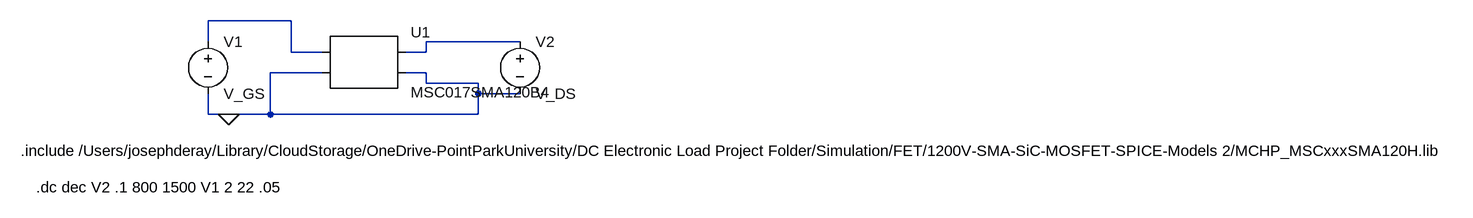
[diagram p0: schematic MSC025SMA120B4-FET-Charcteristics.asc]
MSC025SMA120B4-FET-Charcteristics.asc, the LTspice schematic file:
Version 4
SHEET 1 2020 680
WIRE 288 272 160 272
WIRE 160 304 160 272
WIRE 640 304 496 304
WIRE 288 320 288 272
WIRE 336 320 288 320
WIRE 496 320 496 304
WIRE 496 320 464 320
WIRE 336 352 256 352
WIRE 496 352 464 352
WIRE 496 368 496 352
WIRE 576 368 496 368
WIRE 576 384 576 368
WIRE 640 384 576 384
WIRE 160 416 160 384
WIRE 192 416 160 416
WIRE 256 416 256 352
WIRE 256 416 192 416
WIRE 576 416 576 384
WIRE 576 416 256 416
FLAG 192 416 0
SYMBOL AutoGenerated/MSC017SMA120B4 400 336 R0
SYMATTR InstName U1
SYMBOL voltage 160 288 R0
SYMATTR InstName V1
SYMATTR Value V_GS
SYMBOL voltage 640 288 R0
SYMATTR InstName V2
SYMATTR Value V_DS
TEXT -104 528 Left 2 !.dc dec V2 .1 800 1500 V1 2 22 .05
TEXT -128 472 Left 2 !.include /Users/josephderay/Library/CloudStorage/OneDrive-PointParkUniversity/DC Electronic Load Project Folder/Simulation/FET/1200V-SMA-SiC-MOSFET-SPICE-Models 2/MCHP_MSCxxxSMA120H.lib

The netlist it stands for:
* MSC025SMA120B4-FET-Charcteristics.asc
* U1: MSC017SMA120B4 (symbol AutoGenerated/MSC017SMA120B4 not available, pins judged from their places): pin1=N001 pin2=0 pin3=N002 pin4=0
V1 N001 0 V_GS
V2 N002 0 V_DS
.dc dec V2 .1 800 1500 V1 2 22 .05
.include /Users/josephderay/Library/CloudStorage/OneDrive-PointParkUniversity/DC Electronic Load Project Folder/Simulation/FET/1200V-SMA-SiC-MOSFET-SPICE-Models 2/MCHP_MSCxxxSMA120H.lib
.backanno
.end